# Altium project ADV7180.PrjPcb
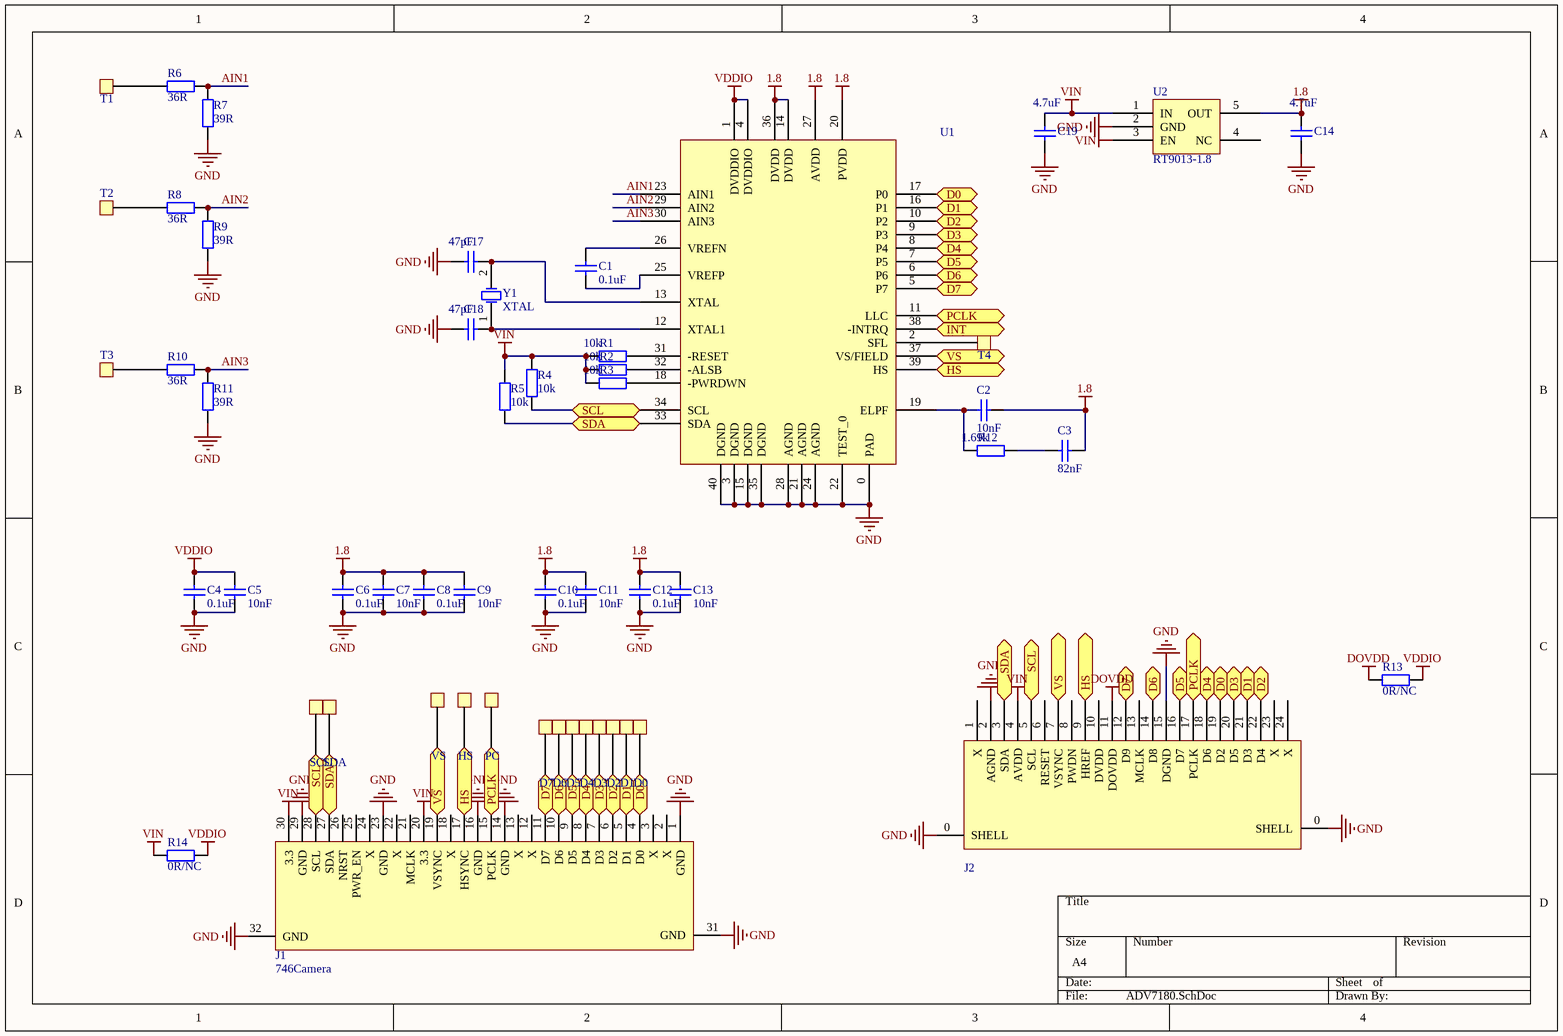
[diagram p0: ADV7180.SchDoc]
1 sheet, 53 parts. Net scope: flat (ports and power ports of the same name join across sheets).
Board file: ADV7180.PcbDoc

## Sheet ADV7180.SchDoc
size A4

### Parts
C1  0.1uF  [0402]
C2  10nF  [0402]
C3  82nF  [0402]
C4  0.1uF  [0402]
C5  10nF  [0402]
C6  0.1uF  [0402]
C7  10nF  [0402]
C8  0.1uF  [0402]
C9  10nF  [0402]
C10  0.1uF  [0402]
C11  10nF  [0402]
C12  0.1uF  [0402]
C13  10nF  [0402]
C14  4.7uF  [0603]
C17  47pF  [0402]
C18  47pF  [0402]
C19  4.7uF  [0603]
D0  TestPad  [TestPad - 1mm]  (value not drawn)
D1  TestPad  [TestPad - 1mm]  (value not drawn)
D2  TestPad  [TestPad - 1mm]  (value not drawn)
D3  TestPad  [TestPad - 1mm]  (value not drawn)
D4  TestPad  [TestPad - 1mm]  (value not drawn)
D5  TestPad  [TestPad - 1mm]  (value not drawn)
D6  TestPad  [TestPad - 1mm]  (value not drawn)
D7  TestPad  [TestPad - 1mm]  (value not drawn)
HS  TestPad  [TestPad - 1mm]  (value not drawn)
J1  746Camera  [FFC/SM0.5-2H30]
J2  Camera24P  [FFC/SM0.5-2H24]  (value not drawn)
PC  TestPad  [TestPad - 1mm]  (value not drawn)
R1  10k  [0402]
R2  10k  [0402]
R3  10k  [0402]
R4  10k  [0402]
R5  10k  [0402]
R6  36R  [0402]
R7  39R  [0402]
R8  36R  [0402]
R9  39R  [0402]
R10  36R  [0402]
R11  39R  [0402]
R12  1.69k  [0402]
R13  0R/NC  [0402]
R14  0R/NC  [0402]
SCL  TestPad  [TestPad - 1mm]  (value not drawn)
SDA  TestPad  [TestPad - 1mm]  (value not drawn)
T1  TestPad  [TestPad]  (value not drawn)
T2  TestPad  [TestPad]  (value not drawn)
T3  TestPad  [TestPad]  (value not drawn)
T4  TestPad  [TestPad - 1mm]  (value not drawn)
U1  ADV7180-40P  [ADV7180 - 40LFCSP]  (value not drawn)
U2  RT9013-1.8  [SOT23-5]
VS  TestPad  [TestPad - 1mm]  (value not drawn)
Y1  XTAL  [5032-crystal]

### Ports
D0, D1, D2, D3, D4, D5, D6, D7, HS, INT, PCLK, SCL, SDA, VS

### Nets
1.8: C2.1 C3.1 C6.1 C7.1 C8.1 C9.1 C10.1 C11.1 C12.1 C13.1 C14.1 U1.14(DVDD) U1.20(PVDD) U1.27(AVDD) U1.36(DVDD) U2.5(OUT)
DOVDD: J2.11(DOVDD) R13.2
GND: C4.2 C5.2 C6.2 C7.2 C8.2 C9.2 C10.2 C11.2 C12.2 C13.2 C14.2 C17.1 C18.1 C19.2 J1.1(GND) J1.14(GND) J1.16(GND) J1.23(GND) J1.29(GND) J1.31(GND) J1.32(GND) J2.0(SHELL) J2.2(AGND) J2.15(DGND) R7.1 R9.1 R11.1 U1.0(PAD) U1.3(DGND) U1.15(DGND) U1.21(AGND) U1.22(TEST_0) U1.24(AGND) U1.28(AGND) U1.35(DGND) U1.40(DGND) U2.2(GND)
VDDIO: C4.1 C5.1 R13.1 R14.1 U1.1(DVDDIO) U1.4(DVDDIO)
VIN: C19.1 J1.20(3.3) J1.30(3.3) J2.4(AVDD) R1.1 R2.1 R3.1 R4.2 R5.2 R14.2 U2.1(IN) U2.3(EN)
AIN1: R6.1 R7.2 U1.23(AIN1)
AIN2: R8.1 R9.2 U1.29(AIN2)
AIN3: R10.1 R11.2 U1.30(AIN3)
NetC1_1: C1.1 U1.25(VREFP)
NetC1_2: C1.2 U1.26(VREFN)
NetC2_2: C2.2 R12.1 U1.19(ELPF)
NetC3_2: C3.2 R12.2
NetC17_2: C17.2 U1.13(XTAL) Y1.2(OSC2)
NetC18_2: C18.2 U1.12(XTAL1) Y1.1(OSC1)
NetD0_1: D0.1 J1.4(D0) J2.19(D2) U1.17(P0) ; port D0
NetD1_1: D1.1 J1.5(D1) J2.21(D3) U1.16(P1) ; port D1
NetD2_1: D2.1 J1.6(D2) J2.22(D4) U1.10(P2) ; port D2
NetD3_1: D3.1 J1.7(D3) J2.20(D5) U1.9(P3) ; port D3
NetD4_1: D4.1 J1.8(D4) J2.18(D6) U1.8(P4) ; port D4
NetD5_1: D5.1 J1.9(D5) J2.16(D7) U1.7(P5) ; port D5
NetD6_1: D6.1 J1.10(D6) J2.14(D8) U1.6(P6) ; port D6
NetD7_1: D7.1 J1.11(D7) J2.12(D9) U1.5(P7) ; port D7
NetHS_1: HS.1 J1.17(HSYNC) J2.9(HREF) U1.39(HS) ; port HS
NetJ1_15: J1.15(PCLK) J2.17(PCLK) PC.1 U1.11(LLC) ; port PCLK
NetJ1_19: J1.19(VSYNC) J2.7(VSYNC) U1.37(VS/FIELD) VS.1 ; port VS
NetJ1_27: J1.27(SDA) J2.3(SDA) R5.1 SDA.1 U1.33(SDA) ; port SDA
NetJ1_28: J1.28(SCL) J2.5(SCL) R4.1 SCL.1 U1.34(SCL) ; port SCL
NetR1_2: R1.2 U1.31(-RESET)
NetR2_2: R2.2 U1.32(-ALSB)
NetR3_2: R3.2 U1.18(-PWRDWN)
NetR6_2: R6.2 T1.1
NetR8_2: R8.2 T2.1
NetR10_2: R10.2 T3.1
NetT4_1: T4.1 U1.2(SFL)
NetU1_38: U1.38(-INTRQ) ; port INT

Not connected (* = marked no-connect by the designer): J1 2(X) 3(X) 12(X) 13(X) 18(X) 21(MCLK) 22(X) 24(X) 25(PWR_EN) 26(NRST); J2 1(X) 6(RESET) 8(PWDN) 10(DVDD) 13(MCLK) 23(X) 24(X); U2 4(NC)

### Library data of the parts
C1-C14 C17-C19 = Cap: Capacitor; Published: 8-Jun-2000; LatestRevisionDate: 17-Jul-2002; LatestRevisionNote: Re-released for DXP Platform.; PackageReference: RAD-0.3; Publisher: Altium Limited; PackageDescription: Radial Cap, Thru-Hole; 2 Leads; 0.3 in Pin Spacing
R1-R14 = Res2: Resistor; Value: 22k 1%; Published: 8-Jun-2000; LatestRevisionDate: 17-Jul-2002; LatestRevisionNote: Re-released for DXP Platform.; PackageReference: AXIAL-0.4; Publisher: Altium Limited; PackageDescription: Axial Device, Thru-Hole; 2 Leads; 0.4 in Pin Spacing
U2 = LP5907
Y1 = XTAL: Crystal Oscillator; Published: 8-Jun-2000; LatestRevisionDate: 17-Jul-2002; LatestRevisionNote: Re-released for DXP Platform.; PackageReference: R38; Publisher: Altium Limited; PackageDescription: Crystal, Thru-Hole; 2 Leads; Body 3.1 x 8.2 mm (Dia.xH)